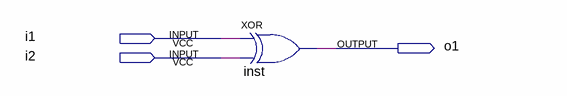
[diagram p0: schematic sheet]
// Quartus schematic xor_2.bdf as structural Verilog: 1 symbols, 3 pins
module xor_2 (
  input  i1,
  input  i2,
  output o1
);

  xor inst (o1, i1, i2);
endmodule
